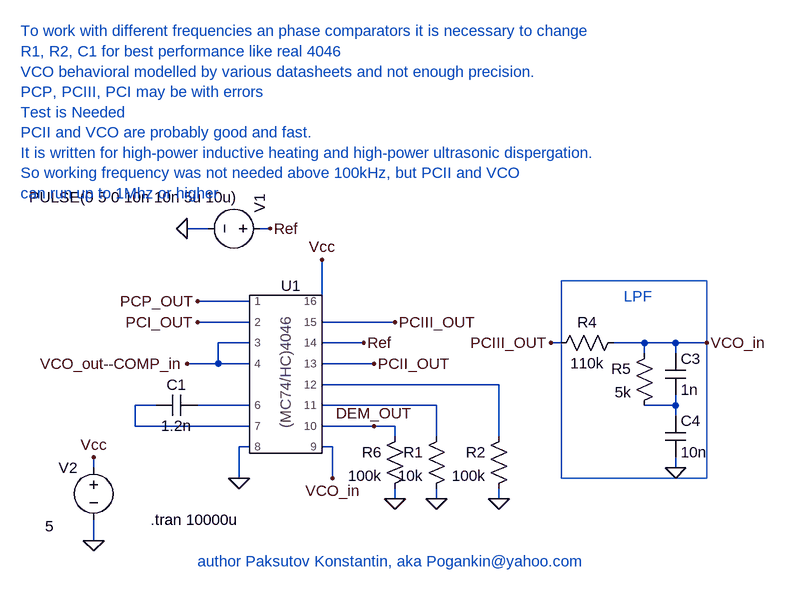
[diagram p0: schematic Full_No_inh_test.asc]
Full_No_inh_test.asc, the LTspice schematic file:
Version 4
SHEET 1 3288 1120
WIRE 1120 -784 1088 -784
WIRE 1216 -784 1200 -784
WIRE 1184 -672 1104 -672
WIRE 1296 -672 1296 -736
WIRE 1184 -640 1104 -640
WIRE 1408 -640 1296 -640
WIRE 1184 -608 1136 -608
WIRE 1360 -608 1296 -608
WIRE 1664 -608 1648 -608
WIRE 1792 -608 1744 -608
WIRE 1840 -608 1792 -608
WIRE 1888 -608 1840 -608
WIRE 1792 -592 1792 -608
WIRE 1840 -592 1840 -608
WIRE 1136 -576 1136 -608
WIRE 1136 -576 1088 -576
WIRE 1184 -576 1136 -576
WIRE 1376 -576 1296 -576
WIRE 1568 -544 1296 -544
WIRE 1040 -512 1008 -512
WIRE 1184 -512 1104 -512
WIRE 1472 -512 1296 -512
WIRE 1840 -512 1840 -528
WIRE 1840 -512 1792 -512
WIRE 1840 -496 1840 -512
WIRE 1008 -480 1008 -512
WIRE 1184 -480 1008 -480
WIRE 1376 -480 1296 -480
WIRE 1408 -480 1376 -480
WIRE 1408 -464 1408 -480
WIRE 1472 -464 1472 -512
WIRE 1568 -464 1568 -544
WIRE 1184 -448 1168 -448
WIRE 1312 -448 1296 -448
WIRE 944 -416 944 -432
WIRE 1840 -416 1840 -432
WIRE 1168 -400 1168 -448
WIRE 1312 -400 1312 -448
WIRE 1408 -368 1408 -384
WIRE 1472 -368 1472 -384
WIRE 1568 -368 1568 -384
WIRE 944 -304 944 -336
FLAG 944 -304 0
FLAG 1840 -416 0
FLAG 1088 -784 0
FLAG 1216 -784 Ref
FLAG 1104 -672 PCP_OUT
FLAG 1104 -640 PCI_OUT
FLAG 1088 -576 VCO_out--COMP_in
FLAG 1168 -400 0
FLAG 1296 -736 Vcc
FLAG 944 -432 Vcc
FLAG 1376 -480 DEM_OUT
FLAG 1408 -368 0
FLAG 1472 -368 0
FLAG 1568 -368 0
FLAG 1376 -576 PCII_OUT
FLAG 1648 -608 PCIII_OUT
FLAG 1312 -400 VCO_in
FLAG 1888 -608 VCO_in
FLAG 1360 -608 Ref
FLAG 1408 -640 PCIII_OUT
SYMBOL res 1488 -480 M0
SYMATTR InstName R1
SYMATTR Value 10k
SYMBOL res 1584 -480 M0
SYMATTR InstName R2
SYMATTR Value 100k
SYMBOL voltage 944 -432 M0
WINDOW 123 0 0 Left 0
WINDOW 39 0 0 Left 0
WINDOW 3 61 106 Left 0
SYMATTR Value 5
SYMATTR InstName V2
SYMBOL res 1760 -624 R90
WINDOW 0 0 56 VBottom 0
WINDOW 3 32 56 VTop 0
SYMATTR InstName R4
SYMATTR Value 110k
SYMBOL res 1808 -608 M0
SYMATTR InstName R5
SYMATTR Value 5k
SYMBOL cap 1824 -592 R0
SYMATTR InstName C3
SYMATTR Value 1n
SYMBOL cap 1824 -496 R0
SYMATTR InstName C4
SYMATTR Value 10n
SYMBOL voltage 1216 -784 M270
WINDOW 123 0 0 Left 0
WINDOW 39 0 0 Left 0
WINDOW 3 48 47 VRight 0
SYMATTR Value PULSE(0 5 0 10n 10n 5u 10u)
SYMATTR InstName V1
SYMBOL res 1424 -480 M0
SYMATTR InstName R6
SYMATTR Value 100k
SYMBOL cap 1104 -528 R90
WINDOW 0 0 32 VBottom 0
WINDOW 3 32 32 VTop 0
SYMATTR InstName C1
SYMATTR Value 1.2n
SYMBOL HC4046 1248 -496 R0
SYMATTR InstName U1
TEXT 1032 -336 Left 0 !.tran 10000u
TEXT 1760 -680 Left 0 ;LPF
TEXT 1104 -272 Left 0 ;author Paksutov Konstantin, aka Pogankin@yahoo.com
TEXT 832 -1088 Left 0 ;To work with different frequencies an phase comparators it is necessary to change\nR1, R2, C1 for best performance like real 4046\nVCO behavioral modelled by various datasheets and not enough precision.\nPCP, PCIII, PCI may be with errors\nTest is Needed\nPCII and VCO are probably good and fast.\nIt is written for high-power inductive heating and high-power ultrasonic dispergation.\nSo working frequency was not needed above 100kHz, but PCII and VCO \ncan run up to 1Mhz or higher
RECTANGLE Normal 1888 -400 1664 -704

The netlist it stands for:
* Full_No_inh_test.asc
R1 N004 0 10k
R2 N001 0 100k
V2 Vcc 0 5
R4 VCO_in PCIII_OUT 110k
R5 VCO_in N005 5k
C3 VCO_in N005 1n
C4 N005 0 10n
V1 Ref 0 PULSE(0 5 0 10n 10n 5u 10u)
R6 DEM_OUT 0 100k
C1 N003 N002 1.2n
XU1 Ref Vcc VCO_out--COMP_in VCO_in PCP_OUT DEM_OUT N004 N001 PCII_OUT PCIII_OUT PCI_OUT VCO_out--COMP_in N003 N002 0 HC4046  ; pins 14 16 3 9 1 10 11 12 13 15 2 4 6 7 8
.tran 10000u
* LPF
* author Paksutov Konstantin, aka Pogankin@yahoo.com
* To work with different frequencies an phase comparators it is necessary to change
* R1, R2, C1 for best performance like real 4046
* VCO behavioral modelled by various datasheets and not enough precision.
* PCP, PCIII, PCI may be with errors
* Test is Needed
* PCII and VCO are probably good and fast.
* It is written for high-power inductive heating and high-power ultrasonic dispergation.
* So working frequency was not needed above 100kHz, but PCII and VCO
* can run up to 1Mhz or higher
.lib ..\sym\Mylib\HC4046.sub
.backanno
.end